# EAGLE design ftdi (EAGLE 6.4)
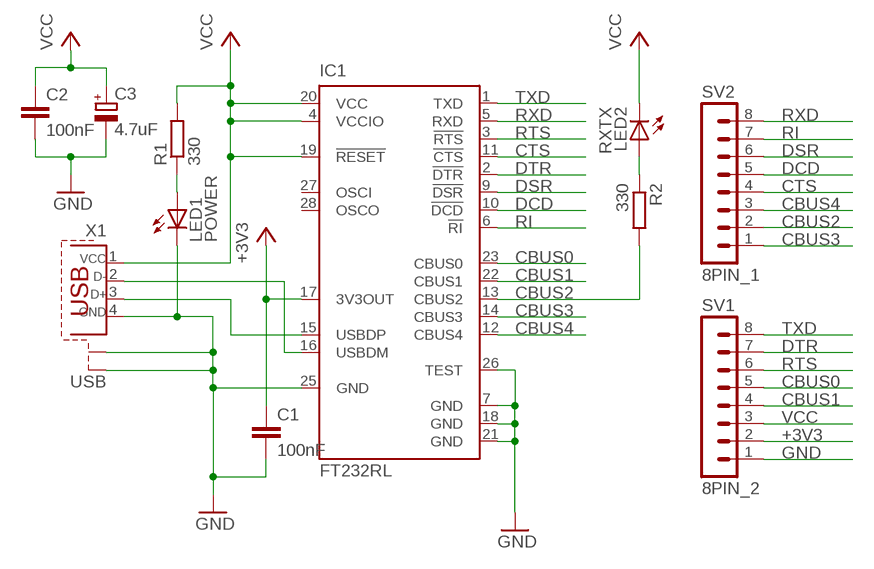
[diagram p0: schematic, sheet 1]

## Parts
C1  100nF  C-EU050-024X044  [C050-024X044]
C2  100nF  C-EU050-024X044  [C050-024X044]
C3  4.7uF  CPOL-EUE5-4  [E5-4]
IC1  FT232RL  [SSOP28]
LED1  POWER  LED3MM  [LED3MM]
LED2  RXTX  LED3MM  [LED3MM]
R1  330  R-EU_0204/7  [0204/7]
R2  330  R-EU_0204/7  [0204/7]
SV1  8PIN_2  MA08-1  [MA08-1]
SV2  8PIN_1  MA08-1  [MA08-1]
X1  USB  PN61729-S  [PN61729-S]

## Nets
+3V3: C1.1 IC1.17(3V3OUT) SV1.2
CBUS0: IC1.23(CBUS0) SV1.5
CBUS1: IC1.22(CBUS1) SV1.4
CBUS2: IC1.13(CBUS2) R2.2 SV2.2
CBUS3: IC1.14(CBUS3) SV2.1
CBUS4: IC1.12(CBUS4) SV2.3
CTS: IC1.11(!CTS) SV2.4
DCD: IC1.10(!DCD) SV2.5
DSR: IC1.9(!DSR) SV2.6
DTR: IC1.2(!DTR) SV1.7
GND: C1.2 C2.2 C3.- IC1.7(GND) IC1.18(GND) IC1.21(GND) IC1.25(GND) IC1.26(TEST) LED1.K(C) SV1.1 X1.4 X1.S1 X1.S2
N$1: LED1.A R1.1
N$2: IC1.16(USBDM) X1.2
N$3: IC1.15(USBDP) X1.3
N$4: LED2.A R2.1
RI: IC1.6(!RI) SV2.7
RTS: IC1.3(!RTS) SV1.6
RXD: IC1.5(RXD) SV2.8
TXD: IC1.1(TXD) SV1.8
VCC: C2.1 C3.+ IC1.4(VCCIO) IC1.19(!RESET) IC1.20(VCC) LED2.K(C) R1.2 SV1.3 X1.1
Unconnected: IC1.27(OSCI) IC1.28(OSCO)

## Library data of the parts
C1 C2 = resistor:C-EU: CAPACITOR, European symbol
C3 = resistor:CPOL-EU: POLARIZED CAPACITOR, European symbol
IC1 = ftdichip:FT232R: Source: http://www.ftdichip.com/Documents/DataSheets/DS_FT232R_v104.pdf; MPN: FT232RL; OC_FARNELL: 1146032; OC_NEWARK: 91K9918
LED1 LED2 = led:LED: LED OSRAM: - CHIPLED LG R971, LG N971, LY N971, LG Q971, LY Q971, LO R971, LY R971 LH N974, LH R974 LS Q976, LO Q976, LY Q976 LO Q996 - Hyper CHIPLED LW Q18S LB Q993, LB Q99A, LB R99A - SideLED LS A670, LO A670, LY A670, LG A670, LP A670 LB A673, LV A673, LT A673, LW A673 LH A674 LY A675 LS A676, LA A676, LO A676, LY A676, LW A676 LS A679, LY A679, LG A679 - Hyper Micro SIDELED® LS Y876, LA Y876, LO Y876, LY Y876 LT Y87S - SmartLED LW L88C, LW L88S LB L89C, LB L89S, LG L890 LS L89K, LO L89K, LY L89K LS L896, LA L896, LO L896, LY L896 - TOPLED LS T670, LO T670, LY T670, LG T670, LP T670 LSG T670, LSP T670, LSY T670, LOP T670, LYG T670 LG T671, LOG T671, LSG T671 LB T673, LV T673, LT T673, LW T673 LH T674 LS T676, LA T676, LO T676, LY T676, LB T676, LH T676, LSB T676, LW T676 LB T67C, LV T67C, LT T67C, LS T67K, LO T67K, LY T67K, LW E67C LS E67B, LA E67B, LO E67B, LY E67B, LB E67C, LV E67C, LT E67C LW T67C LS T679, LY T679, LG T679 LS T770, LO T770, LY T770, LG T770, LP T770 LB T773, LV T773, LT T773, LW T773 LH T774 LS E675, LA E675, LY E675, LS T675 LS T776, LA T776, LO T776, LY T776, LB T776 LHGB T686 LT T68C, LB T68C - Hyper Mini TOPLED® LB M676 - Mini TOPLED Santana® LG M470 LS M47K, LO M47K, LY M47K Source: http://www.osram.convergy.de LUXEON: - LUMILED® LXK2-PW12-R00, LXK2-PW12-S00, LXK2-PW14-U00, LXK2-PW14-V00 LXK2-PM12-R00, LXK2-PM12-S00, LXK2-PM14-U00 LXK2-PE12-Q00, LXK2-PE12-R00, LXK2-PE12-S00, LXK2-PE14-T00, LXK2-PE14-U00 LXK2-PB12-K00, LXK2-PB12-L00, LXK2-PB12-M00, LXK2-PB14-N00, LXK2-PB14-P00, LXK2-PB14-Q00 LXK2-PR12-L00, LXK2-PR12-M00, LXK2-PR14-Q00, LXK2-PR14-R00 LXK2-PD12-Q00, LXK2-PD12-R00, LXK2-PD12-S00 LXK2-PH12-R00, LXK2-PH12-S00 LXK2-PL12-P00, LXK2-PL12-Q00, LXK2-PL12-R00 Source: www.luxeon.com KINGBRIGHT: KA-3528ASYC Source: www.kingbright.com
R1 R2 = resistor:R-EU_: RESISTOR, European symbol
SV1 SV2 = con-lstb:MA08-1: PIN HEADER; OC_FARNELL: unknown; OC_NEWARK: unknown
X1 = con-berg:PN61729-S: BERG USB connector; OC_FARNELL: unknown; OC_NEWARK: unknown

## Board
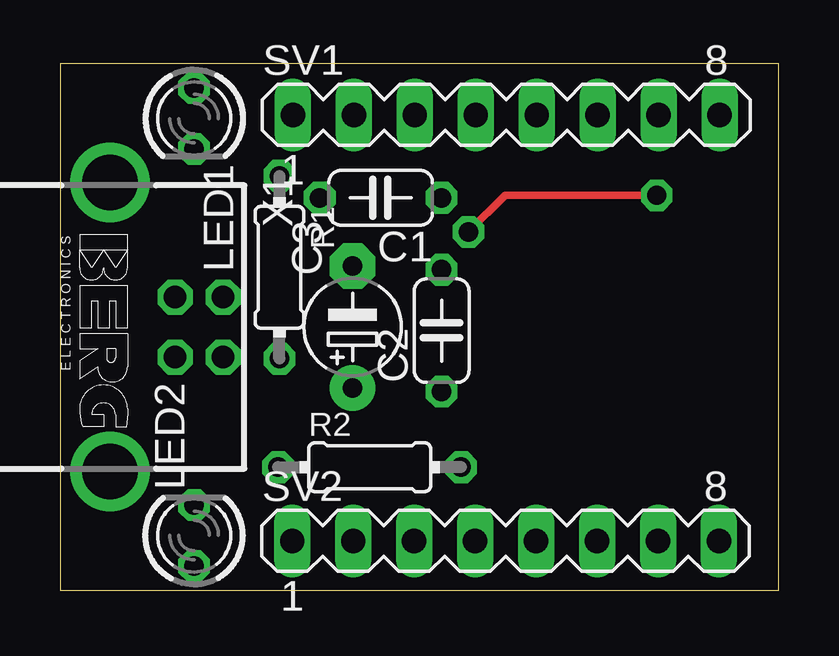
[diagram p1: board, top side]
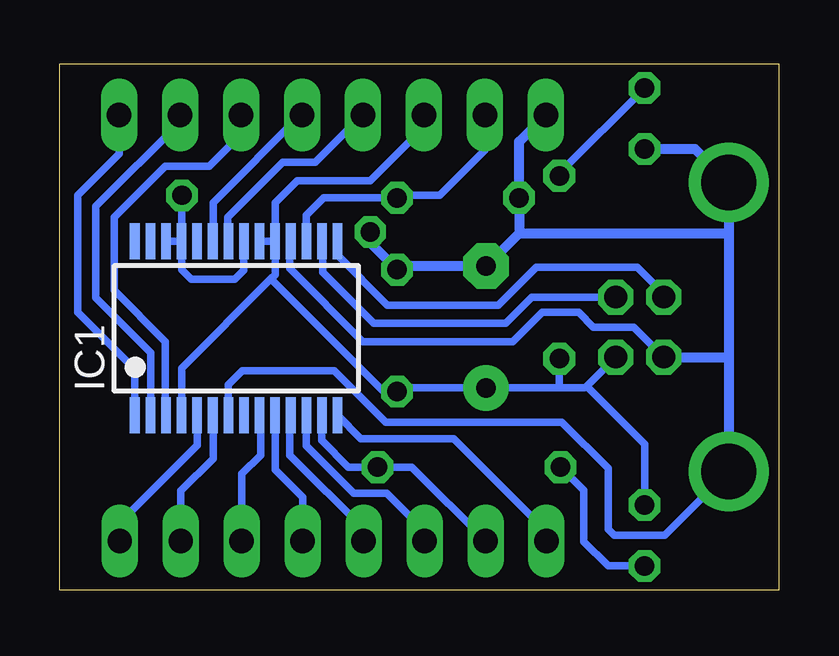
[diagram p2: board, bottom side, seen from below]

Size 29.95 x 21.94 mm. Coordinates in mm from the lower left corner, seen from the top.
Outline: 0,0 29.95,0 29.95,21.94 0,21.94 0,0
Copper layers (1*16): Top 0.035mm / dielectric 1.5mm / Bottom 0.035mm
Design rules "smd": minimum track width 12mil, minimum drill 30mil, track to track 12mil, track to pad 9mil, pad to pad 8mil, via to via 12mil, smd to smd 8mil, copper to edge 12mil, drill to drill 12mil, minimum pad ring 10mil, minimum via ring 10mil, stop-mask expansion 4mil, vias tented up to drill 0mil, thermal gap 12mil

### Footprints (pad centres in the part's own frame; a part is rotated, then mirrored left to right if it is on the bottom)
C050-024X044 = drill 0.813 octagon: 1 -2.54,0; 2 2.54,0
E5-4 = drill 0.813 pad 1.905: + -2.54,0 | drill 0.813 pad 1.905 octagon: - 2.54,0
SSOP28 = smd 0.4 x 1.5: 1 -4.225,-3.625; 2 -3.575,-3.625; 3 -2.925,-3.625; 4 -2.275,-3.625; 5 -1.625,-3.625; 6 -0.975,-3.625; 7 -0.325,-3.625; 8 0.325,-3.625; 9 0.975,-3.625; 10 1.625,-3.625; 11 2.275,-3.625; 12 2.925,-3.625; 13 3.575,-3.625; 14 4.225,-3.625; 15 4.225,3.625; 16 3.575,3.625; 17 2.925,3.625; 18 2.275,3.625; 19 1.625,3.625; 20 0.975,3.625; 21 0.325,3.625; 22 -0.325,3.625; 23 -0.975,3.625; 24 -1.625,3.625; 25 -2.275,3.625; 26 -2.925,3.625; 27 -3.575,3.625; 28 -4.225,3.625
LED3MM = drill 0.813 octagon: A -1.27,0; K 1.27,0
0204/7 = drill 0.813 octagon: 1 -3.81,0; 2 3.81,0
MA08-1 = drill 1.016 long: 1 -8.89,0; 2 -6.35,0; 3 -3.81,0; 4 -1.27,0; 5 1.27,0; 6 3.81,0; 7 6.35,0; 8 8.89,0
PN61729-S = drill 0.95 octagon: 1 1.25,4.71; 2 -1.25,4.71; 3 -1.25,2.71; 4 1.25,2.71 | drill 2.3 pad 2.9: S1 -6.02,0; S2 6.02,0

### Placement (x,y rotation side)
C1  13.36,16.36 180 top
C2  15.9,10.82 90 top
C3  12.19,10.97 90 top
IC1  22.61,10.92 0 bottom
LED1  5.59,19.66 270 top
LED2  5.59,2.29 90 top
R1  9.14,13.46 270 top
R2  12.9,5.13 0 top
SV1  18.59,19.81 0 top
SV2  18.57,2.06 0 top
X1  2.08,10.97 270 top

### Tracks (layer width: path | path; a pad name or v marks a point on that pad's centre or on a via)
+3V3
  Bottom 0.305: SV1.2 12.24,18.34 14.12,16.46 15.8,16.46 C1.1 18.95,16.36 19.68,15.62 IC1.17
CBUS0
  Bottom 0.305: SV1.5 19.91,19.81 23.57,16.15 IC1.23
CBUS1
  Bottom 0.305: IC1.22 22.96,14.58 22.96,15.54 20.68,17.83 19.3,17.83 SV1.4
CBUS2
  Bottom 0.305: IC1.13 19.05,7.28 19.05,6.25 17.93,5.13 R2.2 15.29,5.13 SV2.2
CBUS3
  Bottom 0.305: SV2.1 9.68,2.46 13.54,6.33 17.41,6.33 IC1.14
CBUS4
  Bottom 0.305: SV2.3 14.76,2.46 16.33,4.04 17.7,4.04 19.68,6.02 IC1.12
CTS
  Bottom 0.305: SV2.4 17.3,2.56 20.37,5.64 20.37,7.26 IC1.11
DCD
  Bottom 0.305: SV2.5 19.84,3.89 20.98,5.03 IC1.10
DSR
  Bottom 0.305: SV2.6 22.38,4.85 21.59,5.64 21.59,7.26 IC1.9
DTR
  Bottom 0.305: IC1.2 26.16,7.32 26.16,9.91 28.45,12.19 28.45,16 24.94,19.51 SV1.7
GND  (via drill 0.8)
  Top 0.305: v17.02,14.94 18.54,16.46 v24.87,16.46
  Bottom 0.305: IC1.25 IC1.26 | X1.4 6.04,10.97 7.72,10.97 8.33,11.58 9.86,11.58 11.07,10.36 17.32,10.36 20.37,13.41 20.37,14.51 IC1.18 20.37,14.59 | IC1.25 24.88,13.35 24.49,12.95 22.66,12.95 22.28,13.33 IC1.21 | v24.87,16.46 24.88,16.45 IC1.25 | IC1.7 22.93,8.56 22.35,9.14 18.52,9.14 16.38,7.01 9.04,7.01 7.11,5.08 7.11,2.54 6.86,2.29 4.75,2.29 X1.S2
  Bottom 0.406: SV1.1 10.82,18.69 C1.2 10.82,14.88 | v17.02,14.94 17.02,14.48 C2.2 15.75,13.51 C3.- 10.82,14.88 | 2.08,14.99 X1.S1 3.48,18.39 LED1.K | 2.08,14.99 2.08,9.65 | 2.08,9.65 X1.S2 | X1.4 2.15,9.72 2.08,9.65 | 10.82,14.88 2.18,14.88 2.08,14.99
N$1
  Bottom 0.305: LED1.A 9.14,17.37 R1.1
N$2
  Bottom 0.305: X1.2 10.28,12.22 11.38,11.12 16.87,11.12 19,13.26 19,14.52 IC1.16
N$3
  Bottom 0.305: X1.3 4.79,12.36 5.89,13.46 10.11,13.46 11.68,11.89 16.31,11.89 18.38,13.96 IC1.15
N$4
  Bottom 0.305: LED2.A 7.11,1.02 8.13,2.03 8.13,4.17 R2.1
RI
  Bottom 0.305: SV2.7 24.92,4.14 23.57,5.49 23.57,7.29 IC1.6
RTS
  Bottom 0.305: IC1.3 25.55,7.32 25.55,10.36 27.69,12.5 27.69,15.54 25.55,17.68 23.72,17.68 22.4,19 SV1.6
RXD
  Bottom 0.305: IC1.5 24.23,6.05 27.46,2.82 SV2.8
TXD
  Bottom 0.305: SV1.8 27.48,18.19 29.21,16.46 29.21,11.58 26.83,9.2 IC1.1
VCC
  Bottom 0.305: X1.1 8,8.51 | 8,8.51 8.08,8.43 9.14,8.43 | 9.14,8.43 C3.+ 15.75,8.43 C2.1 16.46,8.28 21.16,12.98 | IC1.19 20.98,13.16 21.16,12.98 | IC1.19 IC1.20 | IC1.4 24.88,9.26 21.16,12.98 | SV1.3 14.78,19.3 17.02,17.07 20.07,17.07 20.98,16.15 IC1.19 | IC1.19 | 9.14,8.43 R1.2 | LED2.K 5.59,6.1 8,8.51

### Text on the board
Document: Yomin@Netz39